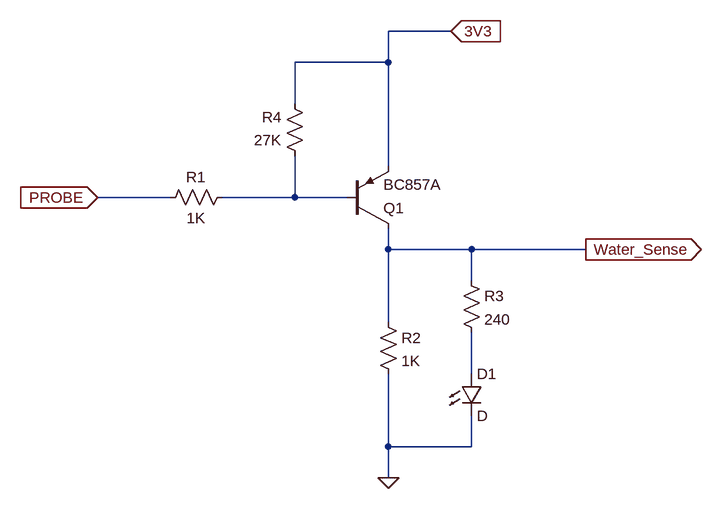
[diagram p0: schematic water_sensor.asc]
water_sensor.asc, the LTspice schematic file:
Version 4
SHEET 1 880 680
WIRE 128 -176 32 -176
WIRE 32 -128 32 -176
WIRE 32 -128 -112 -128
WIRE -112 -64 -112 -128
WIRE 32 32 32 -128
WIRE -304 80 -416 80
WIRE -112 80 -112 16
WIRE -112 80 -224 80
WIRE -32 80 -112 80
WIRE 32 160 32 128
WIRE 160 160 32 160
WIRE 336 160 160 160
WIRE 160 208 160 160
WIRE 32 272 32 160
WIRE 160 352 160 288
WIRE 32 464 32 352
WIRE 160 464 160 416
WIRE 160 464 32 464
WIRE 32 512 32 464
FLAG 128 -176 3V3
IOPIN 128 -176 In
FLAG -416 80 PROBE
IOPIN -416 80 In
FLAG 336 160 Water_Sense
IOPIN 336 160 Out
FLAG 32 512 0
SYMBOL pnp -32 128 M180
SYMATTR InstName Q1
SYMATTR Value BC857A
SYMBOL res -208 64 R90
WINDOW 0 0 56 VBottom 2
WINDOW 3 32 56 VTop 2
SYMATTR InstName R1
SYMATTR Value 1K
SYMATTR SpiceLine tol=1 pwr=0.1
SYMBOL res 144 192 R0
SYMATTR InstName R3
SYMATTR Value 240
SYMATTR SpiceLine tol=1 pwr=0.1
SYMBOL res -96 32 R180
WINDOW 0 36 76 Left 2
WINDOW 3 36 40 Left 2
SYMATTR InstName R4
SYMATTR Value 27K
SYMATTR SpiceLine tol=1 pwr=0.1
SYMBOL LED 144 352 R0
SYMATTR InstName D1
SYMBOL res 16 256 R0
SYMATTR InstName R2
SYMATTR Value 1K
SYMATTR SpiceLine tol=1 pwr=0.1

The netlist it stands for:
* water_sensor.asc
Q1 Water_Sense N001 3V3 0 BC857A
R1 N001 PROBE 1K tol=1 pwr=0.1
R3 Water_Sense N002 240 tol=1 pwr=0.1
R4 N001 3V3 27K tol=1 pwr=0.1
D1 N002 0 D
R2 Water_Sense 0 1K tol=1 pwr=0.1
.model D D
.lib standard.dio
.model NPN NPN
.model PNP PNP
.lib standard.bjt
.backanno
.end